# Altium project SAMV71_Xplained_Ultra.PrjPCB (part 4 of 4)

## Sheet SAMV71_Xplained_Ultra_CAN.SchDoc: CAN
size A3; Organization: Microchip Norway; Address1: Vestre Rosten 79; Address2: N-7075 TILLER; Address3: NORWAY; DocumentNumber: A09-2407; Revision: 12; SheetNumber: 12; SheetTotal: 13; DrawnBy: Microchip Norway; Engineer: AH; PageSetup: Record=PageOptions|CenterHorizontal=True|CenterVertical=True|PrintScale=1.01|XCorrection=1.00|YCorrection=1.00|PrintKind=1|BorderSize=5000000|LeftOffset=0|BottomOffset=0|Orientation=2|PaperLength=1000|PaperWidth=1000|Scale=100|PaperSource=7|PrintQuality=-4|MediaType=1|DitherType=10|PaperKind=A3 (297 x 420 mm)|PrintScaleMode=1; ProjectTitle: SAM V71 Xplained Ultra; PCBNumber: A08-2216; PCBRevision: 4; ProjectName: SAM3X Xplained Pro
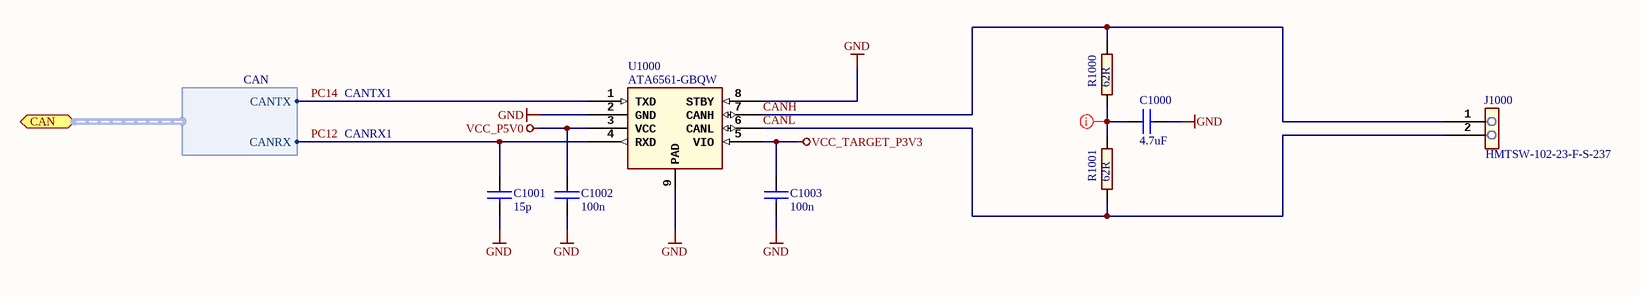
[diagram p12: SAMV71_Xplained_Ultra_CAN.SchDoc]

### Parts
C1000  value 4.7uF  [AP1-00003]
C1001  value 15p  [AP1-00001]
C1002  value 100n  [AP1-00001]
C1003  value 100n  [AP1-00001]
J1000  value HMTSW-102-23-F-S-237  [AP8-00733]
R1000  value 62R  [AP2-00008]  (hidden comment: Generic component)
R1001  value 62R  [AP2-00008]  (hidden comment: Generic component)
U1000  value ATA6561-GBQW  [AP6-00407]

### Ports
CAN (harness CAN)

### Harnesses
CAN: CANTX, CANRX

### Nets
GND: C1000.2 C1001.2 C1002.2 C1003.2 U1000.2(GND) U1000.8(STBY) U1000.9(PAD)
VCC_P5V0: C1002.1 U1000.3(VCC)
VCC_TARGET_P3V3: C1003.1 U1000.5(VIO)
CANH: J1000.1 R1000.2 U1000.7(CANH)
CANL: J1000.2 R1001.1 U1000.6(CANL)
PC12: C1001.1 U1000.4(RXD) ; port CAN.CANRX
PC14: U1000.1(TXD) ; port CAN.CANTX
NetC1000_1: C1000.1 R1000.1 R1001.2

### Layout directives
rule Fabrication Testpoint Usage [Testpoint - Not Allowed    Multiple - Not Allowed]; rule Assembly Testpoint Usage [Testpoint - Not Allowed    Multiple - Not Allowed]: NetC1000_1

### Notes on the sheet
- CANTX1
- CANRX1
- Drawn By:
- Project Title
- Engineer:
- Designed with
- Sheet Title
- Size
- A3
- PCB Number:
- PCB Assembly Number:
- PCBA Revision:
- PCB    Revision:
- Date:
- Altium.com <http://go.altium.com/MicrochipLandingPage_Evaluation.html>
- File:
- Page:

### Library data of the parts
C1000 = A01-0400: Ceramic capacitor, SMD 0805, X5R, 25V, ±10 %; PartGroup: Capacitors,Ceramic,SMD 0805; Manufacturer: Murata; MPN: GRM21BR61E475KA12L; Tolerance: Â±10%; AN: A01-0400; Height: 1,25
C1001 = A01-0017: Ceramic capacitor, SMD 0402, NP0, 50V, +/-5%; PartGroup: Capacitors,Ceramic,SMD 0402; Manufacturer: AVX; MPN: 04025A150JAT2A; TemperatureRange: -55 - +125 deg C; AN: A01-0017; Tolerance: 50V, +/-5%; Height: 0,550000011920929
C1002 C1003 = A01-0246: as C600-C602 on sheet SAMV71_Xplained_Ultra_Memory; AN: A01-0246; Tolerance: 16V, +/-10%; Height: 0,5
J1000 = A08-1754: 1x2 pin header, 2.54mm pitch, Pin-in-Paste THM; PartGroup: Mechanical devices,Connectors,Pin headers; Manufacturer: SAMTEC; TemperatureRange: - 55 deg C to + 125 deg C; AN: A08-1754; Height: 6,09999990463257; MPN: HMTSW-102-23-F-S-237
R1000 R1001 = A02-0760: Thick film resistor, SMD 1210, 0.5W, 1%; PartGroup: Resistors,SMD,1210 1%; Manufacturer: vishay; MPN: CRCW121062R0FKEAHP; TemperatureRange: -55°C to +155°C; AN: A02-0760; Tolerance: 1%; Height: 0,699999988079071
U1000 = A06-1172: 5Mbit/s CAN Trasceiver,VCC = 5V, VIO = 2.8-5V, 3x3 mm VDFN8; PartGroup: Integrated Circuits,Interface ICs,CAN; Manufacturer: ATMEL; AN: A06-1172; Height: 0,899999976158142; MPN: ATA6561-GBQW

## Nets that join several sheets
GND: SAMV71_Xplained_Ultra_Target_MCU (28 pins), SAMV71_Xplained_Ultra_EDBG (35 pins), SAMV71_Xplained_Ultra_Connectors (40 pins), SAMV71_Xplained_Ultra_Power_Supply (35 pins), SAMV71_Xplained_Ultra_Power_Multiplexer (9 pins), SAMV71_Xplained_Ultra_Power_Converter (24 pins), SAMV71_Xplained_Ultra_Ethernet (28 pins), SAMV71_Xplained_Ultra_Memory (33 pins), SAMV71_Xplained_Ultra_Shield_Connectors (6 pins), SAMV71_Xplained_Ultra_Audio (17 pins), SAMV71_Xplained_Ultra_MCU_Peripherals (16 pins), SAMV71_Xplained_Ultra_CAN (7 pins)
VCC_BACKUP_P3V3: SAMV71_Xplained_Ultra_Power_Supply (J102.2 R106.2 U101.1), SAMV71_Xplained_Ultra_Power_Converter (Q106.2 R127.2)
VCC_EDBG_P3V3: SAMV71_Xplained_Ultra_EDBG (24 pins), SAMV71_Xplained_Ultra_Power_Supply (Q101.2 Q108.2 R141.2 R143.2)
VCC_EDBG_USB_P5V0: SAMV71_Xplained_Ultra_EDBG (C908.1 L900.2 U900.A10), SAMV71_Xplained_Ultra_Power_Multiplexer (C105.1 R116.2 U102.3 U102.8)
VCC_EXT_P5V0_P14V0: SAMV71_Xplained_Ultra_Connectors (J405.40), SAMV71_Xplained_Ultra_Power_Supply (6 pins), SAMV71_Xplained_Ultra_Shield_Connectors (J501.8)
VCC_IN_P5V0: SAMV71_Xplained_Ultra_Power_Supply (5 pins), SAMV71_Xplained_Ultra_Power_Multiplexer (Q104.3 R115.2 U102.2)
VCC_MCU_P3V3: SAMV71_Xplained_Ultra_Target_MCU (18 pins), SAMV71_Xplained_Ultra_Power_Supply (J102.1)
VCC_P1V2: SAMV71_Xplained_Ultra_Power_Converter (C120.1 R132.2 U104.23), SAMV71_Xplained_Ultra_Ethernet (6 pins)
VCC_P1V8: SAMV71_Xplained_Ultra_Power_Supply (R136.2), SAMV71_Xplained_Ultra_Power_Converter (C119.1 R128.2 U104.20), SAMV71_Xplained_Ultra_Audio (L805.1 L806.1 R819.1)
VCC_P3V3: SAMV71_Xplained_Ultra_EDBG (R920.2), SAMV71_Xplained_Ultra_Power_Supply (R100.1), SAMV71_Xplained_Ultra_Power_Converter (C116.1 C117.1 L102.2 R124.2)
VCC_P5V0: SAMV71_Xplained_Ultra_Power_Supply (5 pins), SAMV71_Xplained_Ultra_Power_Multiplexer (5 pins), SAMV71_Xplained_Ultra_Power_Converter (16 pins), SAMV71_Xplained_Ultra_Shield_Connectors (J501.5 J506.2 J507.1 J507.2), SAMV71_Xplained_Ultra_CAN (C1002.1 U1000.3)
VCC_TARGET_P3V3: SAMV71_Xplained_Ultra_Target_MCU (J200.1 R231.1 R232.1), SAMV71_Xplained_Ultra_Connectors (13 pins), SAMV71_Xplained_Ultra_Power_Supply (J101.4 R100.2 R102.2 U101.2), SAMV71_Xplained_Ultra_Power_Multiplexer (R120.1 R121.2), SAMV71_Xplained_Ultra_Power_Converter (R134.2), SAMV71_Xplained_Ultra_Ethernet (17 pins), SAMV71_Xplained_Ultra_Memory (38 pins), SAMV71_Xplained_Ultra_Shield_Connectors (J501.2 J501.4), SAMV71_Xplained_Ultra_Audio (6 pins), SAMV71_Xplained_Ultra_MCU_Peripherals (R302.2 R303.2), SAMV71_Xplained_Ultra_CAN (C1003.1 U1000.5)
VCC_TARGET_USB_P5V0: SAMV71_Xplained_Ultra_Power_Multiplexer (C106.1 R117.2 U102.6 U103.1), SAMV71_Xplained_Ultra_MCU_Peripherals (D302.4 J302.1 R305.2)
A0/NBS0: SAMV71_Xplained_Ultra_Target_MCU (R267.2), SAMV71_Xplained_Ultra_Memory (U601.J6)
A2: SAMV71_Xplained_Ultra_Target_MCU (R251.2), SAMV71_Xplained_Ultra_Memory (U601.N6)
A3: SAMV71_Xplained_Ultra_Target_MCU (R252.2), SAMV71_Xplained_Ultra_Memory (U601.P7)
A4: SAMV71_Xplained_Ultra_Target_MCU (R253.2), SAMV71_Xplained_Ultra_Memory (U601.P6)
A5: SAMV71_Xplained_Ultra_Target_MCU (R254.2), SAMV71_Xplained_Ultra_Memory (U601.R6)
A6: SAMV71_Xplained_Ultra_Target_MCU (R255.2), SAMV71_Xplained_Ultra_Memory (U601.R2)
A7: SAMV71_Xplained_Ultra_Target_MCU (R256.2), SAMV71_Xplained_Ultra_Memory (U601.P2)
A8: SAMV71_Xplained_Ultra_Target_MCU (R257.2), SAMV71_Xplained_Ultra_Memory (U601.P1)
A9: SAMV71_Xplained_Ultra_Target_MCU (R258.2), SAMV71_Xplained_Ultra_Memory (U601.N2)
A10: SAMV71_Xplained_Ultra_Target_MCU (R259.2), SAMV71_Xplained_Ultra_Memory (U601.N1)
A11: SAMV71_Xplained_Ultra_Target_MCU (R260.2), SAMV71_Xplained_Ultra_Memory (U601.M2)
ADVREF: SAMV71_Xplained_Ultra_Target_MCU (C218.1 L200.2 U200.9), SAMV71_Xplained_Ultra_Shield_Connectors (J500.8)
BA0: SAMV71_Xplained_Ultra_Target_MCU (R262.2), SAMV71_Xplained_Ultra_Memory (U601.M1)
CAS: SAMV71_Xplained_Ultra_Target_MCU (R263.2), SAMV71_Xplained_Ultra_Memory (U601.K7)
D0: SAMV71_Xplained_Ultra_Target_MCU (R235.2), SAMV71_Xplained_Ultra_Memory (R628.2 R629.1)
D0_LCD: SAMV71_Xplained_Ultra_Connectors (J404.3), SAMV71_Xplained_Ultra_Memory (R628.1)
D1: SAMV71_Xplained_Ultra_Target_MCU (R236.2), SAMV71_Xplained_Ultra_Memory (R627.2 R630.1)
D1_LCD: SAMV71_Xplained_Ultra_Connectors (J404.4), SAMV71_Xplained_Ultra_Memory (R627.1)
D2: SAMV71_Xplained_Ultra_Target_MCU (R237.2), SAMV71_Xplained_Ultra_Memory (R626.2 R631.1)
D2_LCD: SAMV71_Xplained_Ultra_Connectors (J404.5), SAMV71_Xplained_Ultra_Memory (R626.1)
D3: SAMV71_Xplained_Ultra_Target_MCU (R238.2), SAMV71_Xplained_Ultra_Memory (R625.2 R632.1)
D3_LCD: SAMV71_Xplained_Ultra_Connectors (J404.6), SAMV71_Xplained_Ultra_Memory (R625.1)
D4: SAMV71_Xplained_Ultra_Target_MCU (R239.2), SAMV71_Xplained_Ultra_Memory (R624.2 R633.1)
D4_LCD: SAMV71_Xplained_Ultra_Connectors (J404.8), SAMV71_Xplained_Ultra_Memory (R624.1)
D5: SAMV71_Xplained_Ultra_Target_MCU (R240.2), SAMV71_Xplained_Ultra_Memory (R623.2 R634.1)
D5_LCD: SAMV71_Xplained_Ultra_Connectors (J404.9), SAMV71_Xplained_Ultra_Memory (R623.1)
D6: SAMV71_Xplained_Ultra_Target_MCU (R241.2), SAMV71_Xplained_Ultra_Memory (R622.2 R635.1)
D6_LCD: SAMV71_Xplained_Ultra_Connectors (J404.10), SAMV71_Xplained_Ultra_Memory (R622.1)
D7: SAMV71_Xplained_Ultra_Target_MCU (R242.2), SAMV71_Xplained_Ultra_Memory (R621.2 R636.1)
D7_LCD: SAMV71_Xplained_Ultra_Connectors (J404.11), SAMV71_Xplained_Ultra_Memory (R621.1)
D8: SAMV71_Xplained_Ultra_Target_MCU (R243.2), SAMV71_Xplained_Ultra_Memory (R620.2 R637.1)
D8_LCD: SAMV71_Xplained_Ultra_Connectors (J404.13), SAMV71_Xplained_Ultra_Memory (R620.1)
D9: SAMV71_Xplained_Ultra_Target_MCU (R244.2), SAMV71_Xplained_Ultra_Memory (R619.2 R638.1)
D9_LCD: SAMV71_Xplained_Ultra_Connectors (J404.14), SAMV71_Xplained_Ultra_Memory (R619.1)
D10: SAMV71_Xplained_Ultra_Target_MCU (R245.2), SAMV71_Xplained_Ultra_Memory (R618.2 R639.1)
D10_LCD: SAMV71_Xplained_Ultra_Connectors (J404.15), SAMV71_Xplained_Ultra_Memory (R618.1)
D11: SAMV71_Xplained_Ultra_Target_MCU (R246.2), SAMV71_Xplained_Ultra_Memory (R617.2 R640.1)
D11_LCD: SAMV71_Xplained_Ultra_Connectors (J404.16), SAMV71_Xplained_Ultra_Memory (R617.1)
D12: SAMV71_Xplained_Ultra_Target_MCU (R247.2), SAMV71_Xplained_Ultra_Memory (R616.2 R641.1)
D12_LCD: SAMV71_Xplained_Ultra_Connectors (J404.18), SAMV71_Xplained_Ultra_Memory (R616.1)
D13: SAMV71_Xplained_Ultra_Target_MCU (R248.2), SAMV71_Xplained_Ultra_Memory (R615.2 R642.1)
D13_LCD: SAMV71_Xplained_Ultra_Connectors (J404.19), SAMV71_Xplained_Ultra_Memory (R615.1)
D14: SAMV71_Xplained_Ultra_Target_MCU (R249.2), SAMV71_Xplained_Ultra_Memory (R614.2 R643.1)
D14_LCD: SAMV71_Xplained_Ultra_Connectors (J404.20), SAMV71_Xplained_Ultra_Memory (R614.1)
D15: SAMV71_Xplained_Ultra_Target_MCU (R250.2), SAMV71_Xplained_Ultra_Memory (R613.2 R644.1)
D15_LCD: SAMV71_Xplained_Ultra_Connectors (J404.21), SAMV71_Xplained_Ultra_Memory (R613.1)
EDBG_ADC0: SAMV71_Xplained_Ultra_EDBG (U900.K10), SAMV71_Xplained_Ultra_Power_Supply (R102.1 R103.2)
EDBG_TARGET_RESET: SAMV71_Xplained_Ultra_EDBG (U900.B4), SAMV71_Xplained_Ultra_Power_Supply (Q101.3 R143.1)
ID1: SAMV71_Xplained_Ultra_EDBG (R903.1 U900.A1), SAMV71_Xplained_Ultra_Connectors (J401.1)
ID2: SAMV71_Xplained_Ultra_EDBG (R902.1 U900.B2), SAMV71_Xplained_Ultra_Connectors (J402.1)
ID4: SAMV71_Xplained_Ultra_EDBG (R901.1 U900.D3), SAMV71_Xplained_Ultra_Connectors (J404.1)
NetJ400_18: SAMV71_Xplained_Ultra_Target_MCU (R214.1), SAMV71_Xplained_Ultra_Connectors (J400.18)
NetJ401_13: SAMV71_Xplained_Ultra_Target_MCU (R201.2), SAMV71_Xplained_Ultra_Connectors (J401.13)
NetJ401_14: SAMV71_Xplained_Ultra_Target_MCU (R202.2), SAMV71_Xplained_Ultra_Connectors (J401.14)
NetJ401_18: SAMV71_Xplained_Ultra_Target_MCU (R204.2), SAMV71_Xplained_Ultra_Connectors (J401.18)
NetJ402_8: SAMV71_Xplained_Ultra_Target_MCU (R209.2), SAMV71_Xplained_Ultra_Connectors (J402.8)
NetJ402_18: SAMV71_Xplained_Ultra_Target_MCU (R212.2), SAMV71_Xplained_Ultra_Connectors (J402.18)
NetJ404_44: SAMV71_Xplained_Ultra_Target_MCU (R203.1), SAMV71_Xplained_Ultra_Connectors (J404.44)
NetJ500_6: SAMV71_Xplained_Ultra_Target_MCU (R205.2), SAMV71_Xplained_Ultra_Shield_Connectors (J500.6)
NetJ502_1: SAMV71_Xplained_Ultra_Target_MCU (R215.2), SAMV71_Xplained_Ultra_Shield_Connectors (J502.1)
NetJ502_6: SAMV71_Xplained_Ultra_Target_MCU (R216.2), SAMV71_Xplained_Ultra_Shield_Connectors (J502.6)
NetJ502_7: SAMV71_Xplained_Ultra_Target_MCU (R217.2), SAMV71_Xplained_Ultra_Shield_Connectors (J502.7)
NetJ502_8: SAMV71_Xplained_Ultra_Target_MCU (R218.2), SAMV71_Xplained_Ultra_Shield_Connectors (J502.8)
NetJ504_1: SAMV71_Xplained_Ultra_Target_MCU (R219.2), SAMV71_Xplained_Ultra_Shield_Connectors (J504.1)
NetJ504_2: SAMV71_Xplained_Ultra_Target_MCU (R220.2), SAMV71_Xplained_Ultra_Shield_Connectors (J504.2)
NetJ504_3: SAMV71_Xplained_Ultra_Target_MCU (R221.2), SAMV71_Xplained_Ultra_Shield_Connectors (J504.3)
NetJ504_4: SAMV71_Xplained_Ultra_Target_MCU (R222.2), SAMV71_Xplained_Ultra_Shield_Connectors (J504.4)
NetJ505_5: SAMV71_Xplained_Ultra_Target_MCU (R210.2), SAMV71_Xplained_Ultra_Shield_Connectors (J505.5)
NetJ505_6: SAMV71_Xplained_Ultra_Target_MCU (R234.2), SAMV71_Xplained_Ultra_Shield_Connectors (J505.6)
NetJ505_7: SAMV71_Xplained_Ultra_Target_MCU (R208.2), SAMV71_Xplained_Ultra_Shield_Connectors (J505.7)
NetJ505_8: SAMV71_Xplained_Ultra_Target_MCU (R207.2), SAMV71_Xplained_Ultra_Shield_Connectors (J505.8)
NetJ506_3: SAMV71_Xplained_Ultra_Target_MCU (R227.2), SAMV71_Xplained_Ultra_Shield_Connectors (J506.3)
NetJ507_4: SAMV71_Xplained_Ultra_Target_MCU (R211.2), SAMV71_Xplained_Ultra_Shield_Connectors (J507.4)
NetJ507_5: SAMV71_Xplained_Ultra_Target_MCU (R213.2), SAMV71_Xplained_Ultra_Shield_Connectors (J507.5)
NetR200_2: SAMV71_Xplained_Ultra_Target_MCU (R200.2), SAMV71_Xplained_Ultra_Audio (U800.1)
NetR206_1: SAMV71_Xplained_Ultra_Target_MCU (R206.1), SAMV71_Xplained_Ultra_EDBG (U900.J4)
NetR223_2: SAMV71_Xplained_Ultra_Target_MCU (R223.2 R226.2), SAMV71_Xplained_Ultra_Audio (U800.30)
NetR224_2: SAMV71_Xplained_Ultra_Target_MCU (R224.2), SAMV71_Xplained_Ultra_Audio (U800.29)
NetR225_2: SAMV71_Xplained_Ultra_Target_MCU (R225.2), SAMV71_Xplained_Ultra_Audio (R817.2)
NetR228_2: SAMV71_Xplained_Ultra_Target_MCU (R228.2), SAMV71_Xplained_Ultra_Audio (U800.31)
NetR229_2: SAMV71_Xplained_Ultra_Target_MCU (R229.2), SAMV71_Xplained_Ultra_Audio (U800.32)
NetR230_2: SAMV71_Xplained_Ultra_Target_MCU (R230.2), SAMV71_Xplained_Ultra_Audio (U801.5)
NWR1/NBS1: SAMV71_Xplained_Ultra_Target_MCU (R269.2), SAMV71_Xplained_Ultra_Memory (U601.J2)
PA00: SAMV71_Xplained_Ultra_Target_MCU (U200.102), SAMV71_Xplained_Ultra_Connectors (J401.7), SAMV71_Xplained_Ultra_Shield_Connectors (J503.3)
PA01: SAMV71_Xplained_Ultra_Target_MCU (U200.99), SAMV71_Xplained_Ultra_Power_Converter (R134.1 U104.3)
PA02: SAMV71_Xplained_Ultra_Target_MCU (U200.93), SAMV71_Xplained_Ultra_EDBG (R914.1), SAMV71_Xplained_Ultra_Connectors (J402.9 J404.45 J405.16), SAMV71_Xplained_Ultra_Shield_Connectors (J503.8)
PA03: SAMV71_Xplained_Ultra_Target_MCU (R232.2 U200.91), SAMV71_Xplained_Ultra_EDBG (U900.G7), SAMV71_Xplained_Ultra_Connectors (5 pins), SAMV71_Xplained_Ultra_Memory (U600.5 U602.5 U603.5), SAMV71_Xplained_Ultra_Shield_Connectors (J500.9), SAMV71_Xplained_Ultra_Audio (U800.3 U801.10)
PA04: SAMV71_Xplained_Ultra_Target_MCU (R231.2 U200.77), SAMV71_Xplained_Ultra_EDBG (U900.F7), SAMV71_Xplained_Ultra_Connectors (5 pins), SAMV71_Xplained_Ultra_Memory (U600.6 U602.6 U603.6), SAMV71_Xplained_Ultra_Shield_Connectors (J500.10), SAMV71_Xplained_Ultra_Audio (U800.2 U801.9)
PA05: SAMV71_Xplained_Ultra_Target_MCU (U200.73), SAMV71_Xplained_Ultra_Connectors (J400.22 J401.10), SAMV71_Xplained_Ultra_Shield_Connectors (J500.1)
PA06: SAMV71_Xplained_Ultra_Target_MCU (U200.114), SAMV71_Xplained_Ultra_Connectors (J400.10 J402.5 J405.25), SAMV71_Xplained_Ultra_Shield_Connectors (J503.4)
PA07_XIN32: SAMV71_Xplained_Ultra_Target_MCU (U200.35), SAMV71_Xplained_Ultra_MCU_Peripherals (C301.1 XC300.2)
PA08_XOUT32: SAMV71_Xplained_Ultra_Target_MCU (U200.36), SAMV71_Xplained_Ultra_MCU_Peripherals (C300.1 J300.2)
PA09: SAMV71_Xplained_Ultra_Target_MCU (U200.75), SAMV71_Xplained_Ultra_EDBG (R911.1), SAMV71_Xplained_Ultra_Connectors (J400.21), SAMV71_Xplained_Ultra_MCU_Peripherals (R300.2)
PA11: SAMV71_Xplained_Ultra_Target_MCU (U200.64), SAMV71_Xplained_Ultra_Memory (R605.2 U604.1)
PA12: SAMV71_Xplained_Ultra_Target_MCU (U200.68), SAMV71_Xplained_Ultra_Memory (U604.2)
PA13: SAMV71_Xplained_Ultra_Target_MCU (U200.42), SAMV71_Xplained_Ultra_Memory (U604.5)
PA14: SAMV71_Xplained_Ultra_Target_MCU (U200.51), SAMV71_Xplained_Ultra_Memory (U604.6)
PA17: SAMV71_Xplained_Ultra_Target_MCU (U200.25), SAMV71_Xplained_Ultra_Memory (U604.3)
PA18: SAMV71_Xplained_Ultra_Target_MCU (U200.24), SAMV71_Xplained_Ultra_Shield_Connectors (J507.3), SAMV71_Xplained_Ultra_Audio (C800.2 R801.1)
PA19: SAMV71_Xplained_Ultra_Target_MCU (U200.23), SAMV71_Xplained_Ultra_Connectors (J401.4), SAMV71_Xplained_Ultra_Ethernet (R706.1 R720.1 U700.29), SAMV71_Xplained_Ultra_Shield_Connectors (J502.3)
PA21: SAMV71_Xplained_Ultra_Target_MCU (U200.32), SAMV71_Xplained_Ultra_EDBG (R910.1), SAMV71_Xplained_Ultra_Connectors (J402.13), SAMV71_Xplained_Ultra_Shield_Connectors (J507.27)
PA23: SAMV71_Xplained_Ultra_Target_MCU (U200.46), SAMV71_Xplained_Ultra_EDBG (R912.1), SAMV71_Xplained_Ultra_MCU_Peripherals (D301.1)
PA24: SAMV71_Xplained_Ultra_Target_MCU (U200.56), SAMV71_Xplained_Ultra_Connectors (J400.16 J402.10), SAMV71_Xplained_Ultra_Shield_Connectors (J507.26)
PA25: SAMV71_Xplained_Ultra_Target_MCU (U200.59), SAMV71_Xplained_Ultra_Memory (J600.5), SAMV71_Xplained_Ultra_Shield_Connectors (J507.25)
PA26: SAMV71_Xplained_Ultra_Target_MCU (U200.62), SAMV71_Xplained_Ultra_Memory (J600.9 R608.1)
PA27: SAMV71_Xplained_Ultra_Target_MCU (U200.70), SAMV71_Xplained_Ultra_Connectors (J400.25), SAMV71_Xplained_Ultra_Memory (J600.1 R607.1)
PA28: SAMV71_Xplained_Ultra_Target_MCU (U200.112), SAMV71_Xplained_Ultra_Memory (J600.2 R606.1)
PA29: SAMV71_Xplained_Ultra_Target_MCU (U200.129), SAMV71_Xplained_Ultra_Ethernet (U700.32)
PA30: SAMV71_Xplained_Ultra_Target_MCU (U200.116), SAMV71_Xplained_Ultra_Memory (J600.7 R610.1)
PA31: SAMV71_Xplained_Ultra_Target_MCU (U200.118), SAMV71_Xplained_Ultra_Memory (J600.8 R609.1)
PB02: SAMV71_Xplained_Ultra_Target_MCU (U200.26), SAMV71_Xplained_Ultra_Connectors (J401.6 J405.34), SAMV71_Xplained_Ultra_Shield_Connectors (J504.8 J507.20)
PB03: SAMV71_Xplained_Ultra_Target_MCU (U200.31), SAMV71_Xplained_Ultra_Connectors (J400.20 J401.5 J405.27), SAMV71_Xplained_Ultra_Shield_Connectors (J504.7 J507.21)
PB04: SAMV71_Xplained_Ultra_Target_MCU (U200.105), SAMV71_Xplained_Ultra_EDBG (U900.F9), SAMV71_Xplained_Ultra_Connectors (J402.14 J405.2), SAMV71_Xplained_Ultra_Shield_Connectors (J507.28)
PB05: SAMV71_Xplained_Ultra_Target_MCU (U200.109), SAMV71_Xplained_Ultra_EDBG (R921.2), SAMV71_Xplained_Ultra_Connectors (J403.6 J405.10 R403.2)
PB06_SWDIO: SAMV71_Xplained_Ultra_Target_MCU (U200.79), SAMV71_Xplained_Ultra_EDBG (R905.2), SAMV71_Xplained_Ultra_Connectors (J403.2 R400.2)
PB07_SWCLK: SAMV71_Xplained_Ultra_Target_MCU (U200.89), SAMV71_Xplained_Ultra_EDBG (R904.2), SAMV71_Xplained_Ultra_Connectors (J403.4 R401.2)
PB08_XOUT: SAMV71_Xplained_Ultra_Target_MCU (U200.141), SAMV71_Xplained_Ultra_MCU_Peripherals (C302.1 J301.2)
PB09_XIN: SAMV71_Xplained_Ultra_Target_MCU (U200.142), SAMV71_Xplained_Ultra_MCU_Peripherals (C303.1 XC301.1)
PB12: SAMV71_Xplained_Ultra_Target_MCU (J200.2 U200.87), SAMV71_Xplained_Ultra_EDBG (R900.2), SAMV71_Xplained_Ultra_MCU_Peripherals (R301.2)
PB13: SAMV71_Xplained_Ultra_Target_MCU (U200.144), SAMV71_Xplained_Ultra_Connectors (J400.5), SAMV71_Xplained_Ultra_Shield_Connectors (J504.5)
PC08: SAMV71_Xplained_Ultra_Target_MCU (U200.82), SAMV71_Xplained_Ultra_Connectors (J404.35)
PC09_LED: SAMV71_Xplained_Ultra_Target_MCU (J202.1), SAMV71_Xplained_Ultra_Connectors (J404.46), SAMV71_Xplained_Ultra_Shield_Connectors (J500.2), SAMV71_Xplained_Ultra_MCU_Peripherals (D300.1)
PC09_VBUS_DETECT: SAMV71_Xplained_Ultra_Target_MCU (J202.3), SAMV71_Xplained_Ultra_MCU_Peripherals (R305.1 R306.2)
PC10: SAMV71_Xplained_Ultra_Target_MCU (U200.90), SAMV71_Xplained_Ultra_Ethernet (C713.1 R702.1 U700.28)
PC11: SAMV71_Xplained_Ultra_Target_MCU (U200.94), SAMV71_Xplained_Ultra_Connectors (J404.36)
PC12: SAMV71_Xplained_Ultra_Target_MCU (U200.17), SAMV71_Xplained_Ultra_Shield_Connectors (J507.33), SAMV71_Xplained_Ultra_CAN (C1001.1 U1000.4)
PC13: SAMV71_Xplained_Ultra_Target_MCU (U200.19), SAMV71_Xplained_Ultra_Connectors (J402.4 J404.47), SAMV71_Xplained_Ultra_Shield_Connectors (J502.5)
PC14: SAMV71_Xplained_Ultra_Target_MCU (U200.97), SAMV71_Xplained_Ultra_Shield_Connectors (J507.34), SAMV71_Xplained_Ultra_CAN (U1000.1)
PC16: SAMV71_Xplained_Ultra_Target_MCU (U200.100), SAMV71_Xplained_Ultra_MCU_Peripherals (R307.2)
PC17: SAMV71_Xplained_Ultra_Target_MCU (U200.103), SAMV71_Xplained_Ultra_Power_Converter (Q106.1 R127.1)
PC19: SAMV71_Xplained_Ultra_Target_MCU (U200.117), SAMV71_Xplained_Ultra_Connectors (J400.6 J402.7), SAMV71_Xplained_Ultra_Shield_Connectors (J503.7)
PC30: SAMV71_Xplained_Ultra_Target_MCU (U200.15), SAMV71_Xplained_Ultra_Connectors (J401.8 J404.33)
PC31: SAMV71_Xplained_Ultra_Target_MCU (U200.14), SAMV71_Xplained_Ultra_Connectors (J401.3), SAMV71_Xplained_Ultra_Shield_Connectors (J502.2)
PD00: SAMV71_Xplained_Ultra_Target_MCU (U200.1), SAMV71_Xplained_Ultra_Ethernet (R711.1 U700.19), SAMV71_Xplained_Ultra_Shield_Connectors (J504.6)
PD01: SAMV71_Xplained_Ultra_Target_MCU (U200.132), SAMV71_Xplained_Ultra_Ethernet (U700.21)
PD02: SAMV71_Xplained_Ultra_Target_MCU (U200.131), SAMV71_Xplained_Ultra_Ethernet (U700.22)
PD03: SAMV71_Xplained_Ultra_Target_MCU (U200.128), SAMV71_Xplained_Ultra_Ethernet (U700.23)
PD04: SAMV71_Xplained_Ultra_Target_MCU (U200.126), SAMV71_Xplained_Ultra_Connectors (J403.14), SAMV71_Xplained_Ultra_Ethernet (R713.1 R718.2 U700.13)
PD05: SAMV71_Xplained_Ultra_Target_MCU (U200.125), SAMV71_Xplained_Ultra_Connectors (J403.16), SAMV71_Xplained_Ultra_Ethernet (R705.1 R719.1 U700.18)
PD06: SAMV71_Xplained_Ultra_Target_MCU (U200.121), SAMV71_Xplained_Ultra_Connectors (J403.18), SAMV71_Xplained_Ultra_Ethernet (R708.1 R715.1 U700.17)
PD07: SAMV71_Xplained_Ultra_Target_MCU (U200.119), SAMV71_Xplained_Ultra_Connectors (J403.20), SAMV71_Xplained_Ultra_Ethernet (R707.1 R714.1 U700.12)
PD08: SAMV71_Xplained_Ultra_Target_MCU (U200.113), SAMV71_Xplained_Ultra_Connectors (J403.12), SAMV71_Xplained_Ultra_Ethernet (U700.11)
PD09: SAMV71_Xplained_Ultra_Target_MCU (U200.110), SAMV71_Xplained_Ultra_Ethernet (R700.1 U700.10)
PD10: SAMV71_Xplained_Ultra_Target_MCU (U200.101), SAMV71_Xplained_Ultra_Connectors (J405.6)
PD11: SAMV71_Xplained_Ultra_Target_MCU (R200.1 U200.98), SAMV71_Xplained_Ultra_Connectors (J400.23 J402.6), SAMV71_Xplained_Ultra_Shield_Connectors (J503.6)
PD12: SAMV71_Xplained_Ultra_Target_MCU (U200.92), SAMV71_Xplained_Ultra_EDBG (U900.G5), SAMV71_Xplained_Ultra_Connectors (J400.24)
PD18: SAMV71_Xplained_Ultra_Target_MCU (U200.69), SAMV71_Xplained_Ultra_Memory (J600.10 R611.1), SAMV71_Xplained_Ultra_Shield_Connectors (J505.3 J507.8)
PD19: SAMV71_Xplained_Ultra_Target_MCU (U200.67), SAMV71_Xplained_Ultra_Connectors (J404.34), SAMV71_Xplained_Ultra_Shield_Connectors (J505.4 J507.7)
PD20: SAMV71_Xplained_Ultra_Target_MCU (U200.65), SAMV71_Xplained_Ultra_EDBG (R915.2), SAMV71_Xplained_Ultra_Connectors (J401.17 J402.17), SAMV71_Xplained_Ultra_Shield_Connectors (J500.5 J506.1)
PD21: SAMV71_Xplained_Ultra_Target_MCU (R230.1 U200.63), SAMV71_Xplained_Ultra_EDBG (U900.K3), SAMV71_Xplained_Ultra_Connectors (J400.19 J401.16 J402.16), SAMV71_Xplained_Ultra_Shield_Connectors (J500.4 J506.4)
PD24: SAMV71_Xplained_Ultra_Target_MCU (R219.1 R223.1 U200.55), SAMV71_Xplained_Ultra_Connectors (J400.14)
PD25: SAMV71_Xplained_Ultra_Target_MCU (U200.52), SAMV71_Xplained_Ultra_Connectors (J400.12 J401.15), SAMV71_Xplained_Ultra_Shield_Connectors (J500.3)
PD27: SAMV71_Xplained_Ultra_Target_MCU (U200.47), SAMV71_Xplained_Ultra_Connectors (J400.26 J402.15), SAMV71_Xplained_Ultra_Shield_Connectors (J503.5 J505.2)
PD28: SAMV71_Xplained_Ultra_Target_MCU (R203.2 U200.71), SAMV71_Xplained_Ultra_EDBG (R913.1), SAMV71_Xplained_Ultra_Connectors (J400.27 J401.9), SAMV71_Xplained_Ultra_Shield_Connectors (J503.1 J505.1)
PD30: SAMV71_Xplained_Ultra_Target_MCU (U200.34), SAMV71_Xplained_Ultra_Connectors (J400.28 J402.3), SAMV71_Xplained_Ultra_Shield_Connectors (J502.4 J503.2)
PD31: SAMV71_Xplained_Ultra_Target_MCU (U200.2), SAMV71_Xplained_Ultra_Connectors (J400.29), SAMV71_Xplained_Ultra_Memory (U604.7)
RAS: SAMV71_Xplained_Ultra_Target_MCU (R268.2), SAMV71_Xplained_Ultra_Memory (U601.K6)
SDA10: SAMV71_Xplained_Ultra_Target_MCU (R261.2), SAMV71_Xplained_Ultra_Memory (U601.N7)
SDCK: SAMV71_Xplained_Ultra_Target_MCU (R265.2), SAMV71_Xplained_Ultra_Memory (U601.K2)
SDCKE: SAMV71_Xplained_Ultra_Target_MCU (R264.2), SAMV71_Xplained_Ultra_Memory (U601.L1)
SDCS: SAMV71_Xplained_Ultra_Target_MCU (R266.2), SAMV71_Xplained_Ultra_Memory (R604.2 U601.L7)
SDWE: SAMV71_Xplained_Ultra_Target_MCU (R270.2), SAMV71_Xplained_Ultra_Memory (U601.J7)
TARGET_RESET: SAMV71_Xplained_Ultra_Target_MCU (U200.83), SAMV71_Xplained_Ultra_Connectors (J403.10 R402.2), SAMV71_Xplained_Ultra_Power_Supply (5 pins), SAMV71_Xplained_Ultra_Shield_Connectors (J501.3 J506.5)
TARGET_RESET_SENSE: SAMV71_Xplained_Ultra_EDBG (U900.H2), SAMV71_Xplained_Ultra_Power_Supply (R139.1 R141.1)
TARGET_USB_ID: SAMV71_Xplained_Ultra_Power_Multiplexer (R121.1 U103.4), SAMV71_Xplained_Ultra_MCU_Peripherals (J302.4 R307.1)
TARGET_USB_N: SAMV71_Xplained_Ultra_Target_MCU (U200.136), SAMV71_Xplained_Ultra_MCU_Peripherals (D302.3 J302.2)
TARGET_USB_P: SAMV71_Xplained_Ultra_Target_MCU (U200.137), SAMV71_Xplained_Ultra_MCU_Peripherals (D302.2 J302.3)
VBAT: SAMV71_Xplained_Ultra_Power_Supply (R112.1), SAMV71_Xplained_Ultra_Shield_Connectors (J501.1)

## Assembly variants
Default_assembly: not fitted C304 C601 C602 C800 C806 C807 C903 R112 R210 R216 R217 R218 R222 R234 R304 R705 R707 R708 R709 R717 R718 R720 R809 R810 R812 R813 R919 U602 U603